# Altium schematic sheet PowerSys.SchDoc
size A3; Organization: Altium Limited; Address1: L3, 12a Rodborough Rd; Address2: Frenchs Forest; Address3: NSW; Address4: Australia 2086
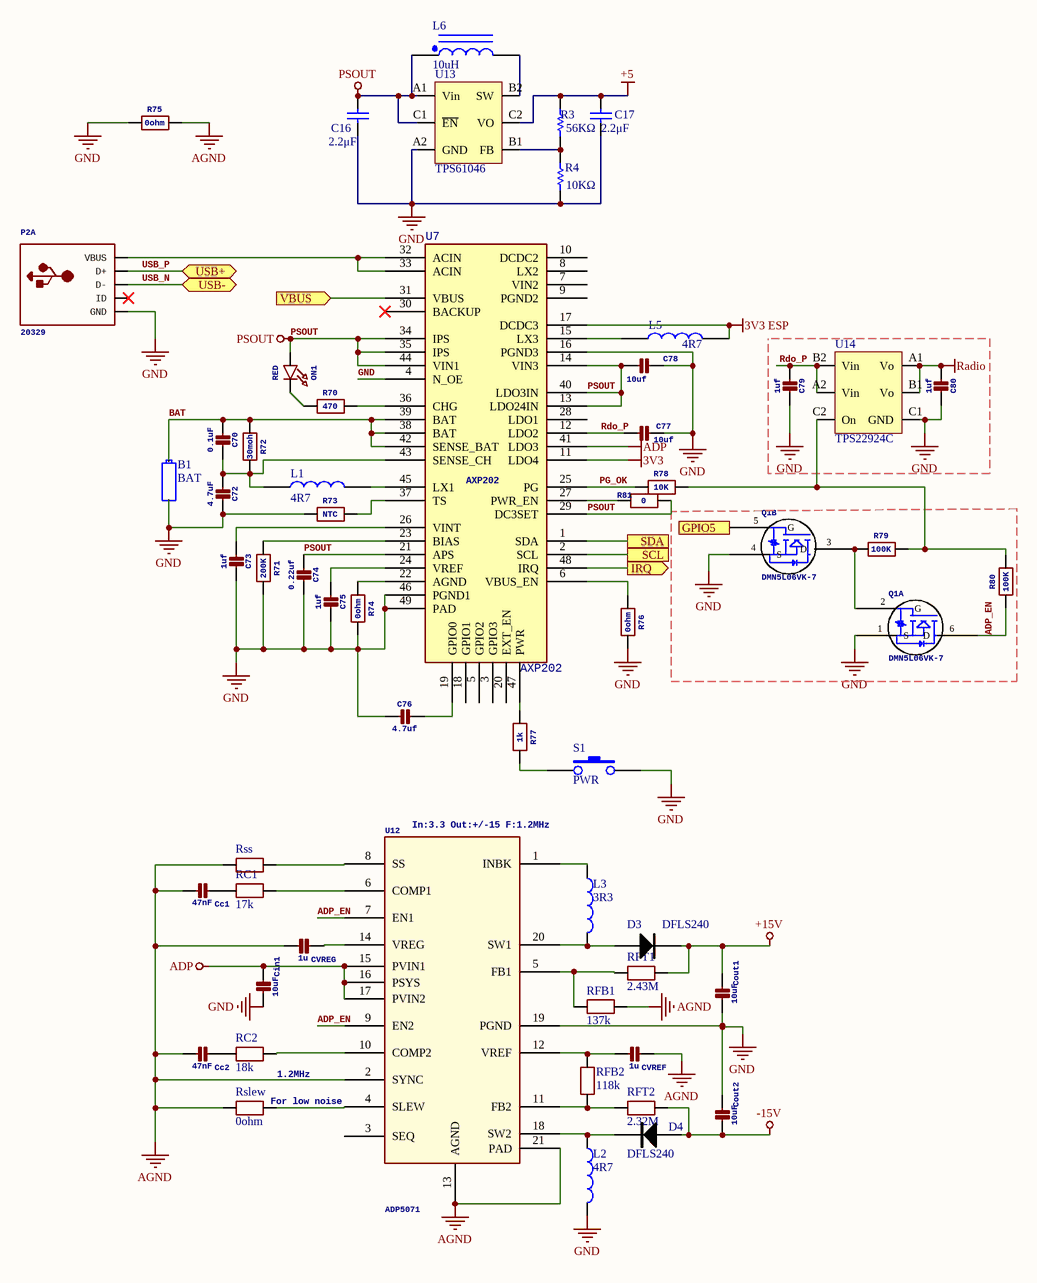
[diagram p0: PowerSys.SchDoc]

## Parts
B1  BAT  [TJC3-2A]
C16  value 2.2μF  [0603 cap]  (hidden comment: 2.2u)
C17  value 2.2μF  [0603 cap]  (hidden comment: 2.2u)
C70  0.1uF  [0603C-GENERIC]
C72  4.7uF  [0603C-GENERIC]
C73  1uf  [0603C-GENERIC]
C74  0.22uf  [0603C-GENERIC]
C75  1uf  [0603C-GENERIC]
C76  4.7uf  [0603C-GENERIC]
C77  10uf  [_0805MP]
C78  10uf  [_0805MP]
C79  1uf  [0201]
C80  1uf  [0201]
Cc1  47nF  [0201]
Cc2  47nF  [0201]
Cin1  10uF  [0805C]
Cout1  10uF  [0805C]
Cout2  10uF  [0805C]
CVREF  1u  [0603AC]
CVREG  1u  [0603AC]
D3  DFLS240  [SOD-123]
D4  DFLS240  [SOD-123]
L1  4R7  [SLF6028]
L2  4R7  [IHLP2525]
L3  3R3  [IHLP2525]
L5  4R7  [SLF6028]
L6  value 10uH  [LPS5030]  (hidden comment: 6R8)
ON1  RED  [CHIPLED_0805_NOOUTLINE]
P2  20329  [USB MICRO]  (part A of 2)
Q1  DMN5L06VK-7  [sot-563]  (parts A,B of 2)
R3  value 56KΩ  [0201]  (hidden comment: 56K)
R4  value 10KΩ  [0201]  (hidden comment: 10K)
R70  470  [0603R-10K]
R71  200K  [0603R-10K]
R72  30moh  [0603R-10K]
R73  NTC  [0603R-10K]
R74  0ohm  [0201]
R75  0ohm  [0402]
R76  0ohm  [0201]
R77  1k  [0603R-10K]
R78  10K  [0603R-10K]
R79  100K  [0201]
R80  100K  [0201]
R81  0  [0603R-10K]
RC1  17k  [0402]
RC2  18k  [0402]
RFB1  137k  [0402]
RFB2  118k  [0402]
RFT1  2.43M  [0402]
RFT2  2.32M  [0402]
Rslew  0ohm  [0201]
Rss  (no value)  [0402]
S1  PWR  [sw_side]
U7  AXP202  [QFN-48-6MM]
U12  ADP5071  [LFCSP-20]
U13  TPS61046  [WCSP-6-DSBGA-6]
U14  TPS22924C  [WCSP-6-DSBGA-6]

## Ports
GPIO5 (in), IRQ (out), SCL, SDA, USB+ (bidir), USB- (bidir), VBUS (in)

## Nets
3V3: U7.11(LDO4)
3V3 ESP: L5.2 U7.17(DCDC3)
+5: C17.2 R3.2 U13.C2(VO)
+15V: Cout1.1 D3.2(K) RFT1.2
-15V: Cout2.2 D4.1(A) RFT2.2
ADP: Cin1.1 U7.41(LDO3) U12.15(PVIN1) U12.16(PSYS) U12.17(PVIN2)
AGND: Cc1.2 Cc2.2 CVREF.1 CVREG.2 R75.2 RFB1.1 Rslew.2 Rss.2 U12.2(SYNC) U12.13(AGND) U12.21(PAD)
GND: B1.2 C16.1 C17.1 C72.1 C73.1 C74.1 C75.1 C76.2 C77.1 C78.1 C79.1 C80.1 Cin1.2 Cout1.2 Cout2.1 L2.2 P2.5(GND) Q1.1(S) Q1.4(S) R4.1 R71.2 R73.1 R74.2 R75.1 R76.2 S1.1 U7.4(N_OE) U7.16(PGND3) U7.46(PGND1) U7.49(PAD) U12.19(PGND) U13.A2(GND) U14.C1(GND)
PSOUT: C16.2 C74.2 C78.2 L6.1 ON1.A R81.2 U7.13(LDO24IN) U7.14(VIN3) U7.21(APS) U7.29(DC3SET) U7.34(IPS) U7.35(IPS) U7.40(LDO3IN) U7.44(VIN1) U13.A1(Vin) U13.C1(~{EN})
Radio: C80.2 U14.A1(Vo) U14.B1(Vo)
ADP_EN: Q1.6(D) R80.1 U12.7(EN1) U12.9(EN2)
BAT: B1.1 C70.2 R72.1 U7.38(BAT) U7.39(BAT) U7.42(SENSE_BAT)
GPIO5: Q1.5(G) ; port GPIO5
IRQ: U7.48(IRQ) ; port IRQ
PG_OK: R78.1 U7.25(PG)
Rdo_P: C77.2 C79.2 U7.12(LDO2) U14.A2(Vin) U14.B2(Vin)
SCL: U7.2(SCL) ; port SCL
SDA: U7.1(SDA) ; port SDA
USB_N: P2.2(D-) ; port USB-
USB_P: P2.3(D+) ; port USB+
VBUS: U7.31(VBUS) ; port VBUS
NetC70_1: C70.1 C72.2 L1.1 R72.2 U7.43(SENSE_CH)
NetC73_2: C73.2 U7.26(VINT)
NetC75_2: C75.2 U7.24(VREF)
NetC76_1: C76.1 U7.19(GPIO0)
NetCc1_1: Cc1.1 RC1.2
NetCc2_1: Cc2.1 RC2.2
NetCVREF_2: CVREF.2 RFB2.1 U12.12(VREF)
NetCVREG_1: CVREG.1 U12.14(VREG)
NetD3_1: D3.1(A) L3.2 U12.20(SW1)
NetD4_2: D4.2(K) L2.1 U12.18(SW2)
NetL1_2: L1.2 U7.45(LX1)
NetL3_1: L3.1 U12.1(INBK)
NetL5_1: L5.1 U7.15(LX3)
NetL6_2: L6.2 U13.B2(SW)
NetON1_C: ON1.C R70.1
NetP2_1: P2.1(VBUS) U7.32(ACIN) U7.33(ACIN)
NetQ1_2: Q1.2(G) Q1.3(D) R79.1
NetR3_1: R3.1 R4.2 U13.B1(FB)
NetR70_2: R70.2 U7.36(CHG)
NetR71_1: R71.1 U7.23(BIAS)
NetR73_2: R73.2 U7.37(TS)
NetR74_1: R74.1 U7.22(AGND)
NetR76_1: R76.1 U7.6(VBUS_EN)
NetR77_1: R77.1 U7.47(PWR)
NetR77_2: R77.2 S1.2
NetR78_2: R78.2 R79.2 R80.2 U14.C2(On)
NetR81_1: R81.1 U7.27(PWR_EN)
NetRC1_1: RC1.1 U12.6(COMP1)
NetRC2_1: RC2.1 U12.10(COMP2)
NetRFB1_2: RFB1.2 RFT1.1 U12.5(FB1)
NetRFB2_2: RFB2.2 RFT2.1 U12.11(FB2)
NetRslew_1: Rslew.1 U12.4(SLEW)
NetRss_1: Rss.1 U12.8(SS)

Not connected (* = marked no-connect by the designer): P2 4(ID)*; U7 3(GPIO3) 5(GPIO2) 7(VIN2) 8(LX2) 9(PGND2) 10(DCDC2) 18(GPIO1) 20(EXT_EN) 28(LDO1) 30(BACKUP)*; U12 3(SEQ)

## Notes on the sheet
- (near U12) In:3.3 Out:+/-15 F:1.2MHz
- 1.2MHz
- (near Rslew) For low noise
- Title
- Size:
- Date:
- A3
- Number:
- Time:
- Revision:
- Sheet
- of
- File:

## Library data of the parts
C16 C17 = Cap0805: Capacitor; Published: 8-Jun-2000; LatestRevisionDate: 17-Jul-2002; LatestRevisionNote: Re-released for DXP Platform.; PackageReference: RAD-0.3; Publisher: Altium Limited; PackageDescription: Radial Cap, Thru-Hole; 2 Leads; 0.3 in Pin Spacing
C70 C72-C80 = CAP_CERAMIC_0805MP: Ceramic CapacitorsFor new designs, use the packages preceded by an '_' character since they are more reliable:The following footprints should be used on most boards:For extremely tight-pitch boards where space is at a premium, the following 'micro-pitch' footprints can be used (smaller pads, no silkscreen outline, etc.):; GateName_1: G$1; SymbolName_1: CAPACITOR; DeviceName: _0805MP; LibraryName: microbuilder; DeviceSetName: CAP_CERAMIC
Cc1 Cc2 Cin1 Cout1 Cout2 CVREF CVREG = CAP: Ceramic CapacitorsFor new designs, use the packages preceded by an '_' character since they are more reliable:The following footprints should be used on most boards:For extremely tight-pitch boards where space is at a premium, the following 'micro-pitch' footprints can be used (smaller pads, no silkscreen outline, etc.):; GateName_1: G$1; DeviceName: 0603-NOOUTLINE; DeviceSetName: CAP_CERAMIC; SymbolName_1: CAPACITOR; LibraryName: microbuilder
D3 D4 = MBRS140: DIODE; Supplier 1: Digi-Key; Supplier Part Number 1: MBRS140FSTR-ND
L1 L5 = INDUCTOR1
L2 L3 = INDUCTOR
L6 = Inductor Iron Dot: Magnetic-Core Inductor with Winding Polarity Marking; Published: 24-Mar-1999; LatestRevisionDate: 17-Jul-2002; LatestRevisionNote: Re-released for DXP Platform.; PackageReference: DIODE_SMC; Publisher: Altium Limited; PackageDescription: Diode; 2 Leads
ON1 = LED0805_NOOUTLINE: LED0603 - 0603 Surface Mount Package 2mA:5mA:0805 - 0805 Surface Mount Package 2mA:20mA:; GateName_1: G$1; SymbolName_1: LED; DeviceName: 0805_NOOUTLINE; LibraryName: microbuilder; DeviceSetName: LED
P2 = USB_W_SHIELD_20329: GateName_1: CONN; SymbolName_1: USB; GateName_2: SHIELD; SymbolName_2: PINHD1; DeviceName: _20329; LibraryName: microbuilder; DeviceSetName: USB_W_SHIELD
Q1 = DMN5L06VK-7: DUAL N-CHANNEL ENHANCEMENT MODE MOSFET SOT-563
R3 R4 = RES: Resistor; Published: 8-Jun-2000; LatestRevisionDate: 17-Jul-2002; LatestRevisionNote: Re-released for DXP Platform.; PackageReference: AXIAL-0.3; Publisher: Altium Limited; PackageDescription: Axial Device, Thru-Hole; 2 Leads; 0.3 in Pin Spacing
R70-R81 = RESISTOR0805_NOOUTLINE: ResistorsFor new designs, use the packages preceded by an '_' character since they are more reliable:The following footprints should be used on most boards:For extremely tight-pitch boards where space is at a premium, the following 'micro-pitch' footprints can be used (smaller pads, no silkscreen outline, etc.):; GateName_1: G$1; SymbolName_1: RESISTOR; DeviceName: 0805_NOOUTLINE; LibraryName: microbuilder; DeviceSetName: RESISTOR
RC1 RC2 RFB1 RFB2 RFT1 RFT2 = RES2: Resistor
Rslew = RES2
Rss = RES2: 4 ms (268 kΩ) and 32 ms (50 kΩ)
S1 = SW-PB
U7 = AXP202: Power system management PWM Charge
U12 = ADP5071: 2 A/1.2 A DC-to-DC Switching Regulator with / Independent Positive and Negative Outputs
U13 = TPS61046: 5V Boost
U14 = TPS22924C: 3.6-V, 2-A, 18.3-mΩ On-Resistance Load Switch